# EAGLE design DipSeq_panel_20141106 (EAGLE 7.1.0)
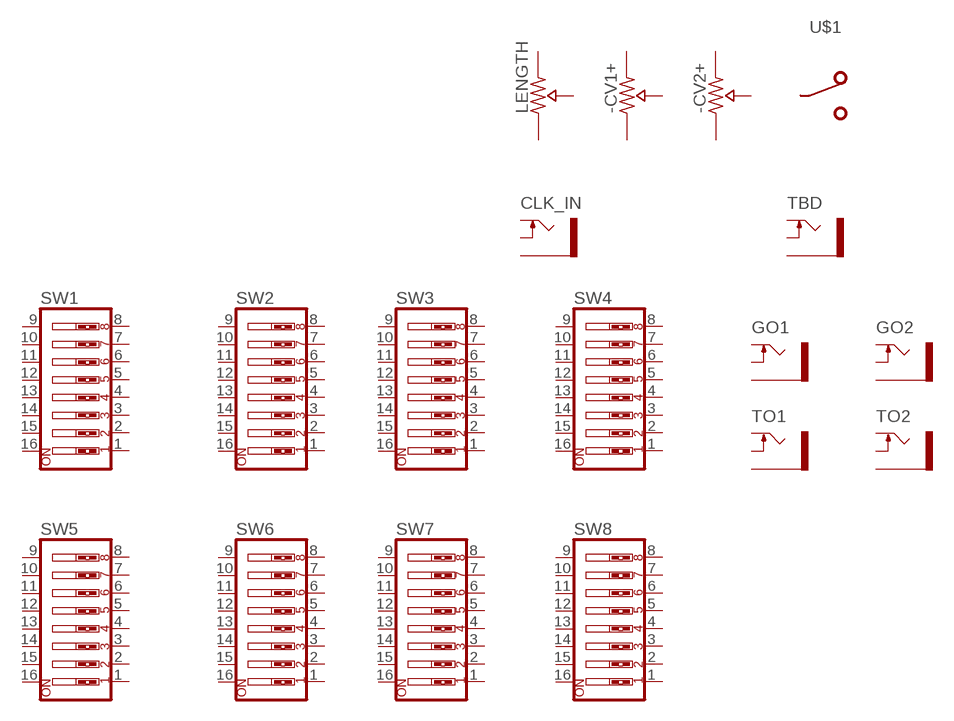
[diagram p0: schematic, sheet 1]

## Parts
-CV1+  POT_PANEL  [POT_KNOB_DAVIES1900H]
-CV2+  POT_PANEL  [POT_KNOB_DAVIES1900H]
CLK_IN  JACK_PANEL  [JACK_PANEL]
GO1  JACK_PANEL  [JACK_PANEL]
GO2  JACK_PANEL  [JACK_PANEL]
LENGTH  POT_PANEL  [POT_KNOB_DAVIES1900H]
SW1  SW_DIP-8  [EDG-08]
SW2  SW_DIP-8  [EDG-08]
SW3  SW_DIP-8  [EDG-08]
SW4  SW_DIP-8  [EDG-08]
SW5  SW_DIP-8  [EDG-08]
SW6  SW_DIP-8  [EDG-08]
SW7  SW_DIP-8  [EDG-08]
SW8  SW_DIP-8  [EDG-08]
TBD  JACK_PANEL  [JACK_PANEL]
TO1  JACK_PANEL  [JACK_PANEL]
TO2  JACK_PANEL  [JACK_PANEL]
U$1  SPDT_PANEL  [SPDT_PANEL]
Unconnected: SW1.1 SW1.2 SW1.3 SW1.4 SW1.5 SW1.6 SW1.7 SW1.8 SW1.9 SW1.10 SW1.11 SW1.12 SW1.13 SW1.14 SW1.15 SW1.16 SW2.1 SW2.2 SW2.3 SW2.4 SW2.5 SW2.6 SW2.7 SW2.8 SW2.9 SW2.10 SW2.11 SW2.12 SW2.13 SW2.14 SW2.15 SW2.16 SW3.1 SW3.2 SW3.3 SW3.4 SW3.5 SW3.6 SW3.7 SW3.8 SW3.9 SW3.10 SW3.11 SW3.12 SW3.13 SW3.14 SW3.15 SW3.16 SW4.1 SW4.2 SW4.3 SW4.4 SW4.5 SW4.6 SW4.7 SW4.8 SW4.9 SW4.10 SW4.11 SW4.12 SW4.13 SW4.14 SW4.15 SW4.16 SW5.1 SW5.2 SW5.3 SW5.4 SW5.5 SW5.6 SW5.7 SW5.8 SW5.9 SW5.10 SW5.11 SW5.12 SW5.13 SW5.14 SW5.15 SW5.16 SW6.1 SW6.2 SW6.3 SW6.4 SW6.5 SW6.6 SW6.7 SW6.8 SW6.9 SW6.10 SW6.11 SW6.12 SW6.13 SW6.14 SW6.15 SW6.16 SW7.1 SW7.2 SW7.3 SW7.4 SW7.5 SW7.6 SW7.7 SW7.8 SW7.9 SW7.10 SW7.11 SW7.12 SW7.13 SW7.14 SW7.15 SW7.16 SW8.1 SW8.2 SW8.3 SW8.4 SW8.5 SW8.6 SW8.7 SW8.8 SW8.9 SW8.10 SW8.11 SW8.12 SW8.13 SW8.14 SW8.15 SW8.16

## Library data of the parts
-CV1+ -CV2+ LENGTH = amdagan:POT_PANEL
CLK_IN GO1 GO2 TBD TO1 TO2 = amdagan:JACK_PANEL
SW1-SW8 = special:SW_DIP-8: DIP SWITCH
U$1 = amdagan:SPDT_PANEL

## Board
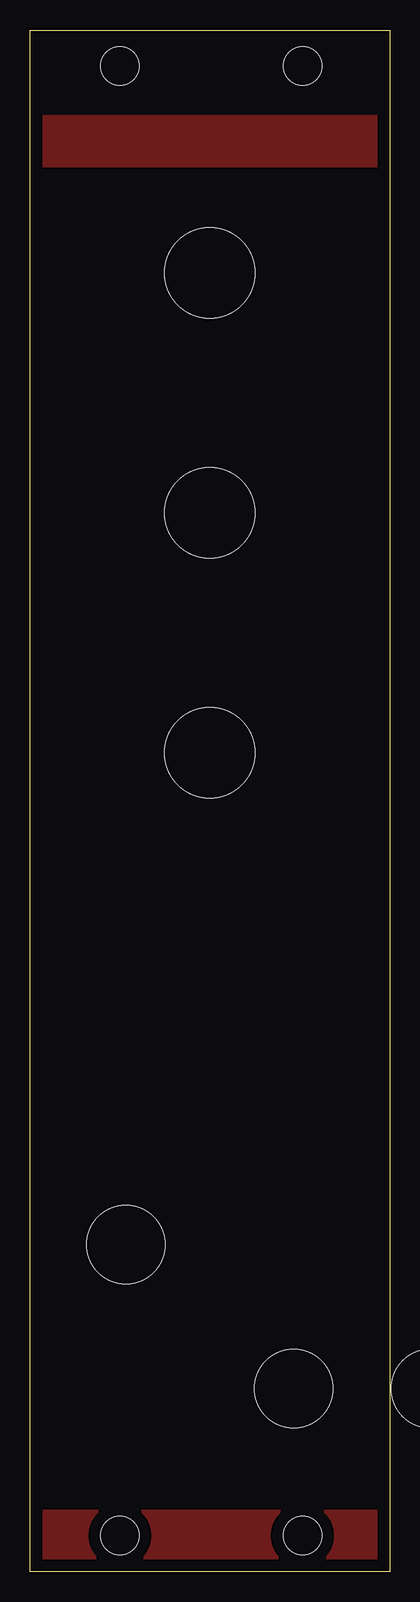
[diagram p1: board, top side]
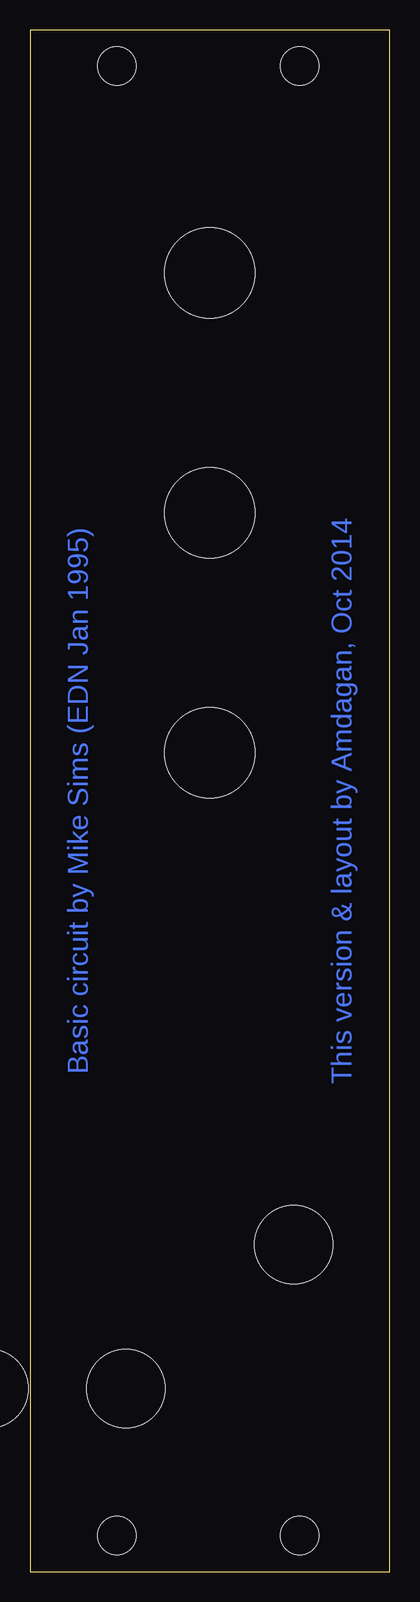
[diagram p2: board, bottom side, seen from below]

Size 30 x 128.5 mm. Coordinates in mm from the lower left corner, seen from the top.
Outline: 0,128.5 30,128.5 30,0 0,0 0,128.5
Copper layers (1*16): Top 0.035mm / dielectric 1.5mm / Bottom 0.035mm
Design rules "default": minimum track width 10mil, minimum drill 24mil, track to track 8mil, track to pad 8mil, pad to pad 8mil, via to via 8mil, smd to smd 8mil, copper to edge 40mil, drill to drill 8mil, minimum pad ring 10mil, minimum via ring 8mil, stop-mask expansion 4mil, vias tented up to drill 0mil, thermal gap 10mil
Holes 3.2 mm at 7.5,3 22.74,3 7.5,125.5 22.74,125.5

### Footprints (pad centres in the part's own frame; a part is rotated, then mirrored left to right if it is on the bottom)
POT_KNOB_DAVIES1900H = hole 7.5: 0,0
JACK_PANEL = hole 6.5: 0,0
EDG-08 = drill 0.813 long: 1 -8.89,-3.81; 2 -6.35,-3.81; 3 -3.81,-3.81; 4 -1.27,-3.81; 5 1.27,-3.81; 6 3.81,-3.81; 7 6.35,-3.81; 8 8.89,-3.81; 9 8.89,3.81; 10 6.35,3.81; 11 3.81,3.81; 12 1.27,3.81; 13 -1.27,3.81; 14 -3.81,3.81; 15 -6.35,3.81; 16 -8.89,3.81
SPDT_PANEL = hole 6.5: 0,0

### Placement (x,y rotation side)
-CV1+  15,88.25 0 top
-CV2+  15,68.25 0 top
CLK_IN  8,27.25 0 top
GO1  33.4,15.25 0 top  (outside the outline)
GO2  61.4,15.25 0 top  (outside the outline)
LENGTH  15,108.25 0 top
SW1  40.4,104.89 90 top  (outside the outline)
SW2  40.4,84.57 90 top  (outside the outline)
SW3  40.4,64.25 90 top  (outside the outline)
SW4  40.4,43.93 90 top  (outside the outline)
SW5  63.26,104.89 270 top  (outside the outline)
SW6  63.26,84.57 270 top  (outside the outline)
SW7  63.26,64.25 270 top  (outside the outline)
SW8  63.26,43.93 270 top  (outside the outline)
TBD  22,15.25 0 top
TO1  47.4,15.25 0 top  (outside the outline)
TO2  75.4,15.25 0 top  (outside the outline)
U$1  40.4,27.25 0 top  (outside the outline)

### Tracks (layer width: path | path; a pad name or v marks a point on that pad's centre or on a via)
N$1
  pour Top: 0,117.25 0,121.25 30,121.25 30,117.25
  pour Top: 0,1 0,5 30,5 30,1

### Text on the board
Bottom: This version & layout by Amdagan, Oct 2014 | Basic circuit by Mike Sims (EDN Jan 1995)
tStop: DIPSEQ #1 | AC | DC | amdagan
tDocu: Hole sizes: / / Thonkiconn jack / bushing dia 6mm -> hole 6.5 mm / / 9mm Alpha pot / bushing dia 7mm -> hole 7.5 mm / case protrusion 2x0.8mm, 6mm below -> hole 2.2mm / nut 10mm between parallel sides / washer dia 12mm / 300 deg rotation / Knob: Davies 1900H clone dia 12.7mm / / 16mm trad pot - Alpha 3RP/1610N / bushing 7mm -> hole 7.5mm / 300 +/-5 deg rotation / Tayda A-322 knob: bottom dia. 16mm / / 9mm Alpha plastic shaft / shaft dia 6mm -> hole 6.5mm / / SPDT (Tayda A-4567, A-5108) / shaft dia 5.9mm > hole 6.5mm / shaft length 8.8mm / height (back of FP to top of PCB) 10mm / hex nut diameters 8mm / 9mm / hex nut height 1.6mm / lock washer dia 10.2mm, height 1.8mm / lug washer dia. 12mm, height 0.5mm / lug hole dia >2.2mm / lug hole center 6.5mm from switch axis, along togglig axis / lug protrudes ~2.2mm | TODO: / add AC/DC switch? / possibly add indicator LED for sum of CVs